# Altium project slave.PrjPcb
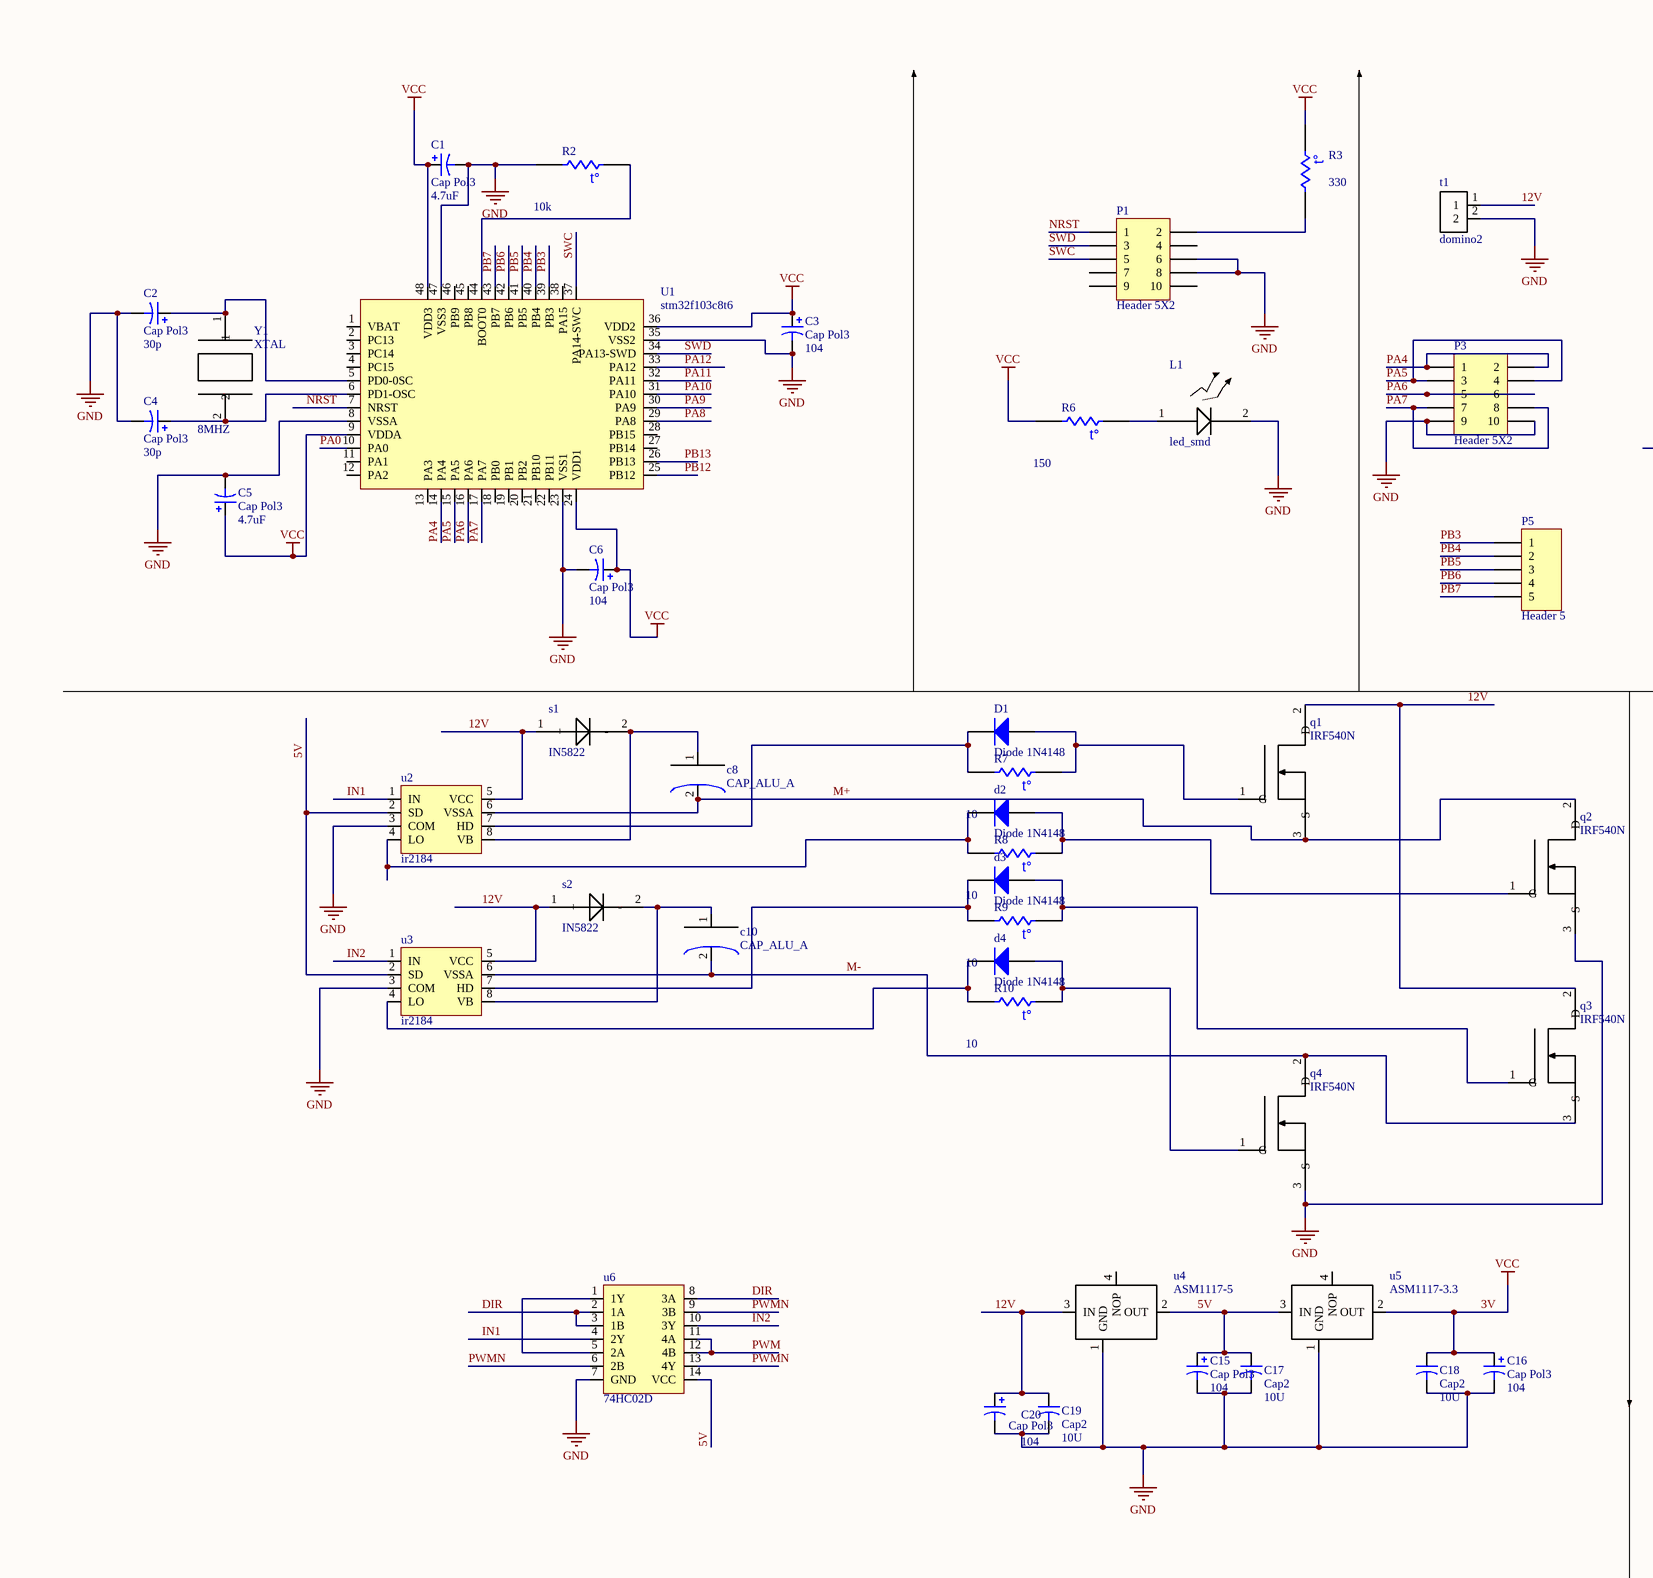
[diagram p0: Sheet1.SchDoc, left]
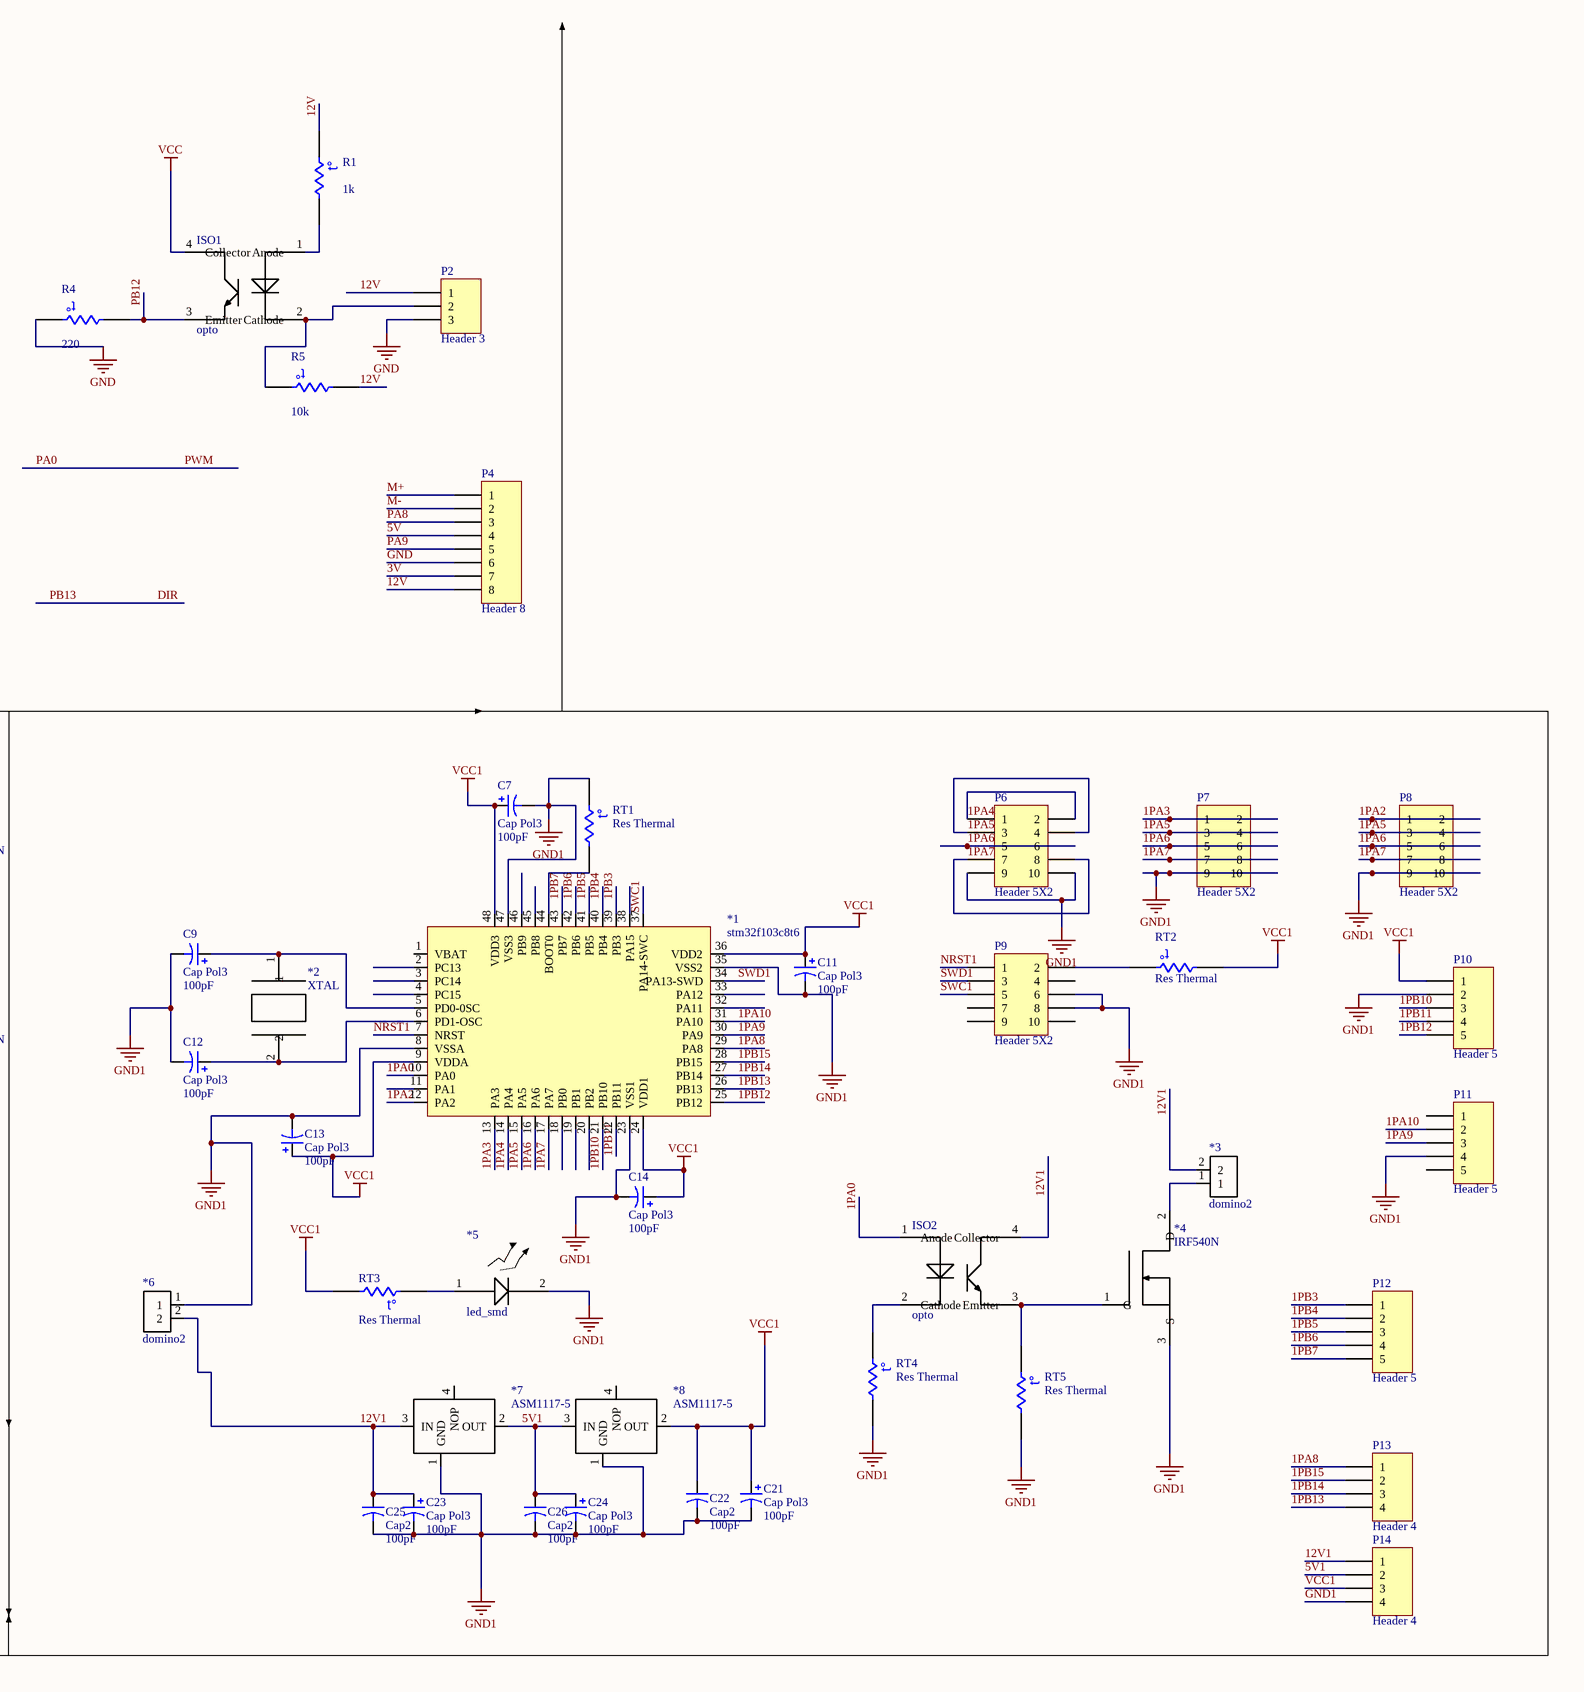
[diagram p1: Sheet1.SchDoc, right]
1 sheet, 84 parts. Net scope: global (net labels, ports and power ports of the same name join across sheets).
Board file: slave.PcbDoc

## Sheet Sheet1.SchDoc
size A1

### Parts
*1  stm32f103c8t6  [LQFP48_stm32]
*2  XTAL  [xtal_smd]
*3  domino2  [Domino_2]
*4  IRF540N  [TO220]
*5  led_smd  [led_smd]
*6  domino2  [Domino_2]
*7  ASM1117-5  [SOT223]
*8  ASM1117-5  [SOT223]
C1  Cap Pol3  value 4.7uF  [C0805]
C2  Cap Pol3  value 30p  [C0805]
C3  Cap Pol3  value 104  [C0805]
C4  Cap Pol3  value 30p  [C0805]
C5  Cap Pol3  value 4.7uF  [C0805]
C6  Cap Pol3  value 104  [C0805]
C7  Cap Pol3  value 100pF  [C0805]
c8  CAP_ALU_A  [cap_alu_a]
C9  Cap Pol3  value 100pF  [C0805]
c10  CAP_ALU_A  [cap_alu_a]
C11  Cap Pol3  value 100pF  [C0805]
C12  Cap Pol3  value 100pF  [C0805]
C13  Cap Pol3  value 100pF  [C0805]
C14  Cap Pol3  value 100pF  [C0805]
C15  Cap Pol3  value 104  [C0805]
C16  Cap Pol3  value 104  [C0805]
C17  Cap2  value 10U  [CAPR5-4X5]
C18  Cap2  value 10U  [CAPR5-4X5]
C19  Cap2  value 10U  [CAPR5-4X5]
C20  Cap Pol3  value 104  [C0805]
C21  Cap Pol3  value 100pF  [C0805]
C22  Cap2  value 100pF  [CAPR5-4X5]
C23  Cap Pol3  value 100pF  [C0805]
C24  Cap Pol3  value 100pF  [C0805]
C25  Cap2  value 100pF  [CAPR5-4X5]
C26  Cap2  value 100pF  [CAPR5-4X5]
D1  Diode 1N4148  [DO-35]
d2  Diode 1N4148  [DO-35]
d3  Diode 1N4148  [DO-35]
d4  Diode 1N4148  [DO-35]
ISO1  opto  [opto_smd]
ISO2  opto  [opto_smd]
L1  led_smd  [led_smd]
P1  Header 5X2  [HDR2X5]
P2  Header 3  [HDR1X3]
P3  Header 5X2  [HDR2X5]
P4  Header 8  [HDR1X8]
P5  Header 5  [HDR1X5]
P6  Header 5X2  [HDR2X5]
P7  Header 5X2  [HDR2X5]
P8  Header 5X2  [HDR2X5]
P9  Header 5X2  [HDR2X5]
P10  Header 5  [HDR1X5]
P11  Header 5  [HDR1X5]
P12  Header 5  [HDR1X5]
P13  Header 4  [HDR1X4]
P14  Header 4  [HDR1X4]
q1  IRF540N  [TO220]
q2  IRF540N  [TO220]
q3  IRF540N  [TO220]
q4  IRF540N  [TO220]
R1  value 1k  [6-0805_N]
R2  value 10k  [6-0805_N]
R3  value 330  [6-0805_N]
R4  value 220  [6-0805_N]
R5  value 10k  [6-0805_N]
R6  value 150  [6-0805_N]
R7  value 10  [6-0805_N]
R8  value 10  [6-0805_N]
R9  value 10  [6-0805_N]
R10  value 10  [6-0805_N]
RT1  Res Thermal  [6-0805_N]
RT2  Res Thermal  [6-0805_N]
RT3  Res Thermal  [6-0805_N]
RT4  Res Thermal  [6-0805_N]
RT5  Res Thermal  [6-0805_N]
s1  IN5822  [schottky diode]
s2  IN5822  [schottky diode]
t1  domino2  [Domino_2]
U1  stm32f103c8t6  [LQFP48_stm32]
u2  ir2184  [SOP8_ir2184]
u3  ir2184  [SOP8_ir2184]
u4  ASM1117-5  [SOT223]
u5  ASM1117-3.3  [SOT223]
u6  74HC02D  [SOP14_Nor gate]
Y1  XTAL  value 8MHZ  [xtal_smd]

### Nets
3V: C1.1 C3.1 C5.1 C6.1 C16.1 C18.1 ISO1.4(Collector) P4.7 R3.1 R6.2 U1.9(VDDA) U1.24(VDD1) U1.36(VDD2) U1.48(VDD3) u5.2(OUT)  [also labelled VCC]
GND: C1.2 C2.2 C3.2 C4.2 C5.2 C6.2 C15.2 C16.2 C17.2 C18.2 C19.2 C20.2 L1.2 P1.6 P1.8 P2.3 P3.9 P3.10 P4.6 q2.3(S) q4.3(S) R2.2 R4.1 t1.2 U1.8(VSSA) U1.23(VSS1) U1.35(VSS2) U1.47(VSS3) u2.3(COM) u3.3(COM) u4.1(GND) u5.1(GND) u6.7(GND)
GND1: *1.8(VSSA) *1.23(VSS1) *1.35(VSS2) *1.47(VSS3) *4.3(S) *5.2 *6.1 *7.1(GND) *8.1(GND) C7.2 C9.2 C11.2 C12.2 C13.2 C14.2 C21.2 C22.2 C23.2 C24.2 C25.2 C26.2 P6.9 P6.10 P7.9 P7.10 P8.9 P8.10 P9.6 P9.8 P10.2 P11.4 P14.4 RT1.1 RT4.2 RT5.2
VCC1: *1.9(VDDA) *1.24(VDD1) *1.36(VDD2) *1.48(VDD3) *8.2(OUT) C7.1 C11.1 C13.1 C14.1 C21.1 C22.1 P10.1 P14.3 RT2.2 RT3.2
1PA0: *1.10(PA0) ISO2.1(Anode)
1PA2: *1.12(PA2) P8.1 P8.2
1PA3: *1.13(PA3) P7.1 P7.2
1PA4: *1.14(PA4) P6.1 P6.2
1PA5: *1.15(PA5) P6.3 P6.4 P7.3 P7.4 P8.3 P8.4
1PA6: *1.16(PA6) P6.5 P6.6 P7.5 P7.6 P8.5 P8.6
1PA7: *1.17(PA7) P6.7 P6.8 P7.7 P7.8 P8.7 P8.8
1PA8: *1.29(PA8) P13.1
1PA9: *1.30(PA9) P11.3
1PA10: *1.31(PA10) P11.2
1PB3: *1.39(PB3) P12.1
1PB4: *1.40(PB4) P12.2
1PB5: *1.41(PB5) P12.3
1PB6: *1.42(PB6) P12.4
1PB7: *1.43(PB7) P12.5
1PB10: *1.21(PB10) P10.3
1PB11: *1.22(PB11) P10.4
1PB12: *1.25(PB12) P10.5
1PB13: *1.26(PB13) P13.4
1PB14: *1.27(PB14) P13.3
1PB15: *1.28(PB15) P13.2
5V: C15.1 C17.1 P4.4 u2.2(SD) u3.2(SD) u4.2(OUT) u5.3(IN) u6.14(VCC)
5V1: *7.2(OUT) *8.3(IN) C24.1 C26.1 P14.2
12V: C19.1 C20.1 P2.1 P4.8 q1.2(D) q3.2(D) R1.1 R5.2 s1.1(+) s2.1(+) t1.1 u2.5(VCC) u3.5(VCC) u4.3(IN)
12V1: *3.2 *6.2 *7.3(IN) C23.1 C25.1 ISO2.4(Collector) P14.1
DIR: U1.26(PB13) u6.2(1A) u6.3(1B) u6.8(3A)  [also labelled PB13]
IN1: u2.1(IN) u6.4(2Y)
IN2: u3.1(IN) u6.10(3Y)
M+: c8.2(-) P4.1 q1.3(S) q2.2(D) u2.6(VSSA)
M-: c10.2(-) P4.2 q3.3(S) q4.2(D) u3.6(VSSA)
NRST: P1.1 U1.7(NRST)
NRST1: *1.7(NRST) P9.1
PA0: U1.10(PA0) u6.11(4A) u6.12(4B)  [also labelled PWM]
PA4: P3.1 P3.2 U1.14(PA4)
PA5: P3.3 P3.4 U1.15(PA5)
PA6: P3.5 P3.6 U1.16(PA6)
PA7: P3.7 P3.8 U1.17(PA7)
PA8: P4.3 U1.29(PA8)
PA9: P4.5 U1.30(PA9)
PA10: U1.31(PA10)
PA11: U1.32(PA11)
PA12: U1.33(PA12)
PB3: P5.1 U1.39(PB3)
PB4: P5.2 U1.40(PB4)
PB5: P5.3 U1.41(PB5)
PB6: P5.4 U1.42(PB6)
PB7: P5.5 U1.43(PB7)
PB12: ISO1.3(Emitter) R4.2 U1.25(PB12)
PWMN: u6.6(2B) u6.9(3B) u6.13(4Y)
SWC: P1.5 U1.37(PA14-SWC)
SWC1: *1.37(PA14-SWC) P9.5
SWD: P1.3 U1.34(PA13-SWD)
SWD1: *1.34(PA13-SWD) P9.3
Net*1_5: *1.5(PD0-0SC) *2.1 C9.1
Net*1_6: *1.6(PD1-OSC) *2.2 C12.1
Net*1_44: *1.44(BOOT0) RT1.2
Net*3_1: *3.1 *4.2(D)
Net*4_1: *4.1(G) ISO2.3(Emitter) RT5.1
Net*5_1: *5.1 RT3.1
NetC2_1: C2.1 U1.5(PD0-0SC) Y1.1
NetC4_1: C4.1 U1.6(PD1-OSC) Y1.2
Netc8_1: c8.1(+) s1.2(-) u2.8(VB)
Netc10_1: c10.1(+) s2.2(-) u3.8(VB)
NetD1_1: D1.1(A) q1.1(G) R7.1
NetD1_2: D1.2(K) R7.2 u2.7(HD)
Netd2_1: d2.1(A) q2.1(G) R8.1
Netd2_2: d2.2(K) R8.2 u2.4(LO)
Netd3_1: d3.1(A) q3.1(G) R9.1
Netd3_2: d3.2(K) R9.2 u3.7(HD)
Netd4_1: d4.1(A) q4.1(G) R10.1
Netd4_2: d4.2(K) R10.2 u3.4(LO)
NetISO1_1: ISO1.1(Anode) R1.2
NetISO1_2: ISO1.2(Cathode) P2.2 R5.1
NetISO2_2: ISO2.2(Cathode) RT4.1
NetL1_1: L1.1 R6.1
NetP1_2: P1.2 R3.2
NetP9_2: P9.2 RT2.1
NetR2_1: R2.1 U1.44(BOOT0)
Netu6_1: u6.1(1Y) u6.5(2A)

Not connected (* = marked no-connect by the designer): *1 1(VBAT) 2(PC13) 3(PC14) 4(PC15) 11(PA1) 18(PB0) 19(PB1) 20(PB2) 32(PA11) 33(PA12) 38(PA15) 45(PB8) 46(PB9); *7 4(NOP); *8 4(NOP); P1 4 7 9 10; P9 4 7 9 10; P11 1 5; U1 1(VBAT) 2(PC13) 3(PC14) 4(PC15) 11(PA1) 12(PA2) 13(PA3) 18(PB0) 19(PB1) 20(PB2) 21(PB10) 22(PB11) 27(PB14) 28(PB15) 38(PA15) 45(PB8) 46(PB9); u4 4(NOP); u5 4(NOP)

### Notes on the sheet
- (in symbol Res Thermal) t°

### Library data of the parts
C1-C7 C9 C11-C16 C20 C21 C23 C24 = Cap Pol3: Polarized Capacitor (Surface Mount); Published: 8-Jun-2000; LatestRevisionDate: 29-May-2009; LatestRevisionNote: IPC-7351 Footprint Added.; PackageReference: C0805; Publisher: Altium Limited; PackageDescription: Chip Capacitor
C17-C19 C22 C25 C26 = Cap2: Capacitor; Published: 23-Sep-2002; PackageReference: CAPR5-4X5; Publisher: Altium Limited; PackageDescription: Capacitor; 2 Leads
D1 d2-d4 = Diode 1N4148: High Conductance Fast Diode; Published: 8-Jun-2000; LatestRevisionDate: 17-Jul-2002; LatestRevisionNote: Re-released for DXP Platform.; DatasheetVersion: 1997; PackageReference: DO-35; Publisher: Altium Limited; PackageDescription: Diode, Axial; Body 3.8 x 1.9 mm (LxDia. max), Lead Dia. 0.53 mm (max); Code_JEDEC: DO-204-AH; ComponentLink1Description: Manufacturer Link; ComponentLink1URL: http://www.fairchildsemi.com/; ComponentLink2Description: Datasheet; ComponentLink2URL: http://www.fairchildsemi.com/ds/1N%2F1N4148.pdf
P1 P3 P6-P9 = Header 5X2: Header, 5-Pin, Dual row; LatestRevisionDate: 17-Jul-2002; LatestRevisionNote: Re-released for DXP Platform.; Publisher: Altium Limited
P2 = Header 3: Header, 3-Pin; LatestRevisionDate: 17-Jul-2002; LatestRevisionNote: Re-released for DXP Platform.; Publisher: Altium Limited
P4 = Header 8: Header, 8-Pin; LatestRevisionDate: 17-Jul-2002; LatestRevisionNote: Re-released for DXP Platform.; Publisher: Altium Limited
P5 P10-P12 = Header 5: Header, 5-Pin; LatestRevisionDate: 17-Jul-2002; LatestRevisionNote: Re-released for DXP Platform.; Publisher: Altium Limited
P13 P14 = Header 4: Header, 4-Pin; LatestRevisionDate: 17-Jul-2002; LatestRevisionNote: Re-released for DXP Platform.; Publisher: Altium Limited
R1-R10 RT1-RT5 = Res Thermal: Thermistor; Published: 24-Mar-1999; LatestRevisionDate: 29-May-2009; LatestRevisionNote: IPC-7351 Footprint Added.; PackageVersion: Mar-2003; PackageReference: 6-0805; Publisher: Altium Limited; PackageDescription: Chip Resistor 0805 Case Size; Code_IPC: RESC2012
u5 = ASM1117-5